# Altium schematic sheet TB88_only_Sheet1.SchDoc
size A4
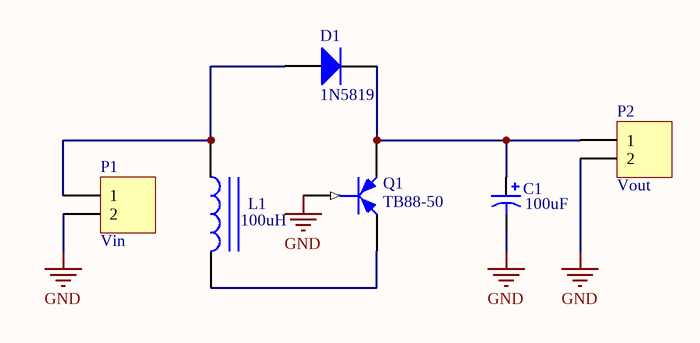
[diagram p0: TB88_only_Sheet1.SchDoc]

## Parts
C1  value 100uF  [CAPPR5-5x5]
D1  1N5819  [DIO10.46-5.3x2.8]
L1  value 100uH  [AXIAL-0.9]
P1  Vin  [HDR1X2]
P2  Vout  [HDR1X2]
Q1  TB88-50  [SOT89L]

## Nets
GND: C1.2 P1.2 P2.2 Q1.1(B)
NetC1_1: C1.1 D1.2(K) P2.1 Q1.2(E)
NetD1_1: D1.1(A) L1.1 P1.1
NetL1_2: L1.2 Q1.3(C)

## Library data of the parts
C1 = Cap Pol1: Polarized Capacitor (Radial); Published: 8-Jun-2000; LatestRevisionDate: 17-Jul-2002; LatestRevisionNote: Re-released for DXP Platform.; PackageReference: RB7.6-15; Publisher: Altium Limited
D1 = Diode 1N4001: 1 Amp General Purpose Rectifier; Published: 8-Jun-2000; LatestRevisionDate: 17-Jul-2002; LatestRevisionNote: Re-released for DXP Platform.; DatasheetVersion: 1998; PackageVersion: Aug-1999; PackageReference: DO-41; Publisher: Altium Limited; Code_JEDEC: DO-204-AL; ComponentLink1Description: Manufacturer Link; ComponentLink1URL: http://www.fairchildsemi.com/; ComponentLink2Description: Datasheet; ComponentLink2URL: http://www.fairchildsemi.com/ds/1N%2F1N4001.pdf
L1 = Inductor Iron: Magnetic-Core Inductor; Published: 24-Mar-1999; LatestRevisionDate: 17-Jul-2002; LatestRevisionNote: Re-released for DXP Platform.; PackageReference: AXIAL-0.9; Publisher: Altium Limited
P1 P2 = Header 2: Header, 2-Pin; LatestRevisionDate: 17-Jul-2002; LatestRevisionNote: Re-released for DXP Platform.; Publisher: Altium Limited
Q1 = Diac-PNP: DIAC; Published: 24-Mar-1999; LatestRevisionDate: 29-May-2009; LatestRevisionNote: IPC-7351 Footprint Added.; PackageVersion: Jul-2004; PackageReference: SOT89; Publisher: Altium Limited; PackageDescription: 3-Pin SOT-89 Package 1.5 mm Pitch, 4.1 mm Lead Span; Code_JEDEC: TO-243-AA